# Altium project i9plug_RELES_RecC2.PrjPcb
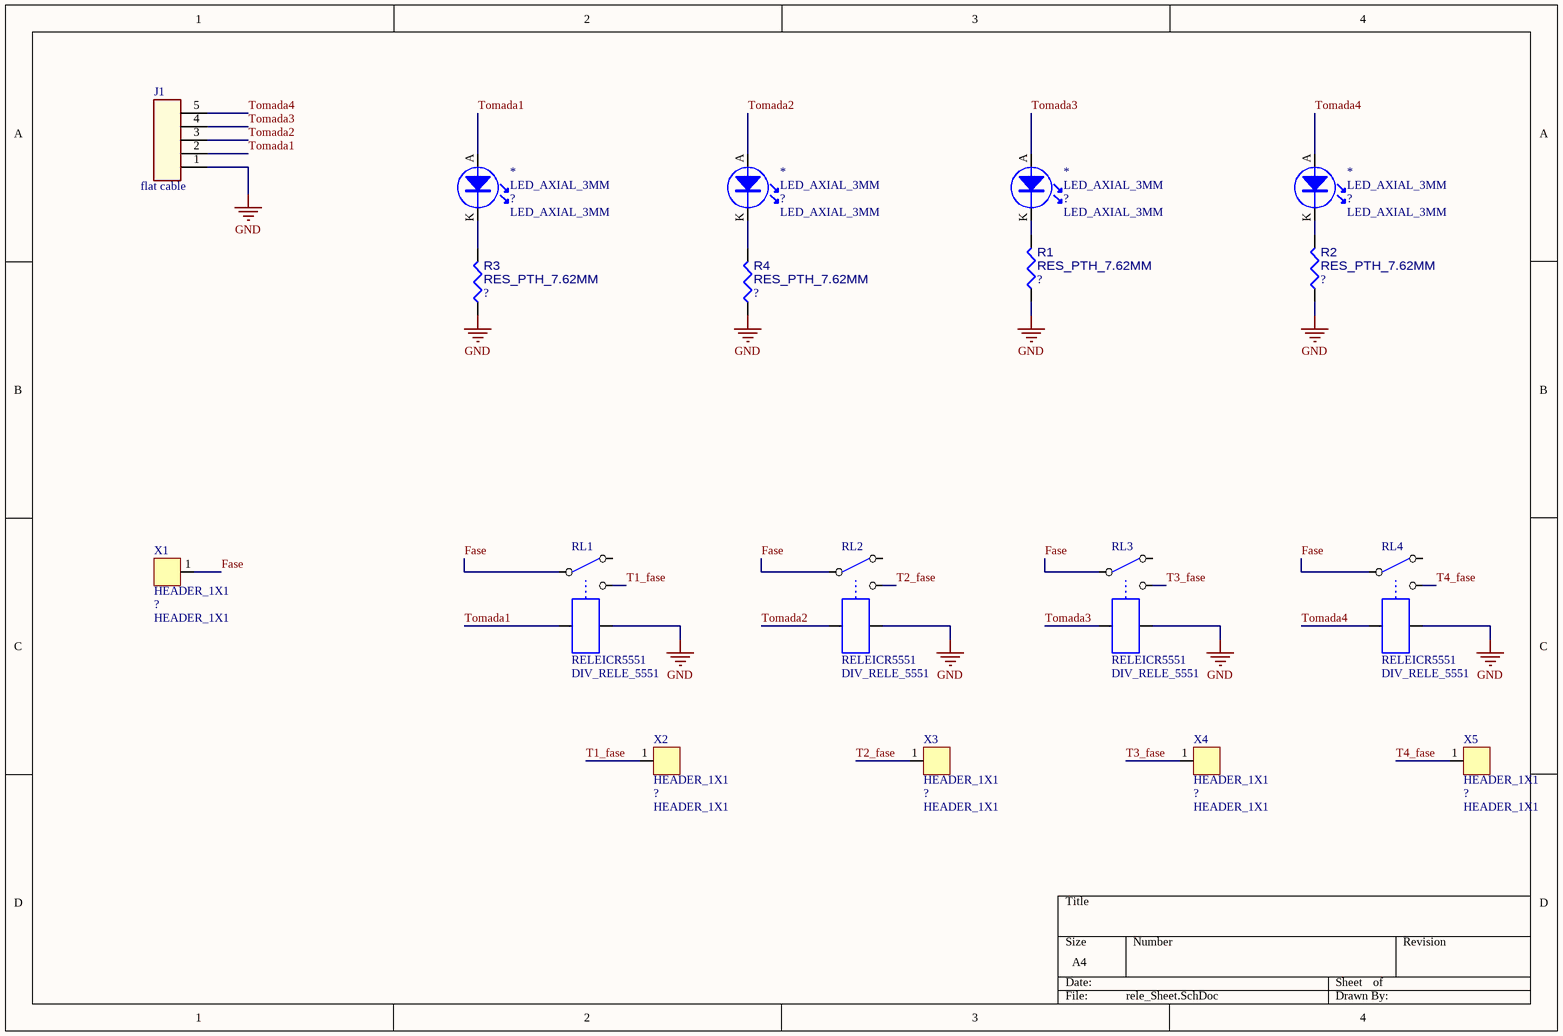
[diagram p0: rele_Sheet.SchDoc]
1 sheet, 18 parts. Net scope: global (net labels, ports and power ports of the same name join across sheets).
Board file: PCB1.PcbDoc

## Sheet rele_Sheet.SchDoc
size A4

### Parts
(Parts that share a designator on the sheet are numbered #1, #2 ... from top to bottom, then left to right.)
*#1  LED_AXIAL_3MM  [LED_AXIAL_3MM]
*#2  LED_AXIAL_3MM  [LED_AXIAL_3MM]
*#3  LED_AXIAL_3MM  [LED_AXIAL_3MM]
*#4  LED_AXIAL_3MM  [LED_AXIAL_3MM]
J1  flat cable  [Pin Header 5 Ways]
R1  ?  [RES_PTH_7.62MM]
R2  ?  [RES_PTH_7.62MM]
R3  ?  [RES_PTH_7.62MM]
R4  ?  [RES_PTH_7.62MM]
RL1  RELEICR5551  [DIV_RELE_5551]
RL2  RELEICR5551  [DIV_RELE_5551]
RL3  RELEICR5551  [DIV_RELE_5551]
RL4  RELEICR5551  [DIV_RELE_5551]
X1  HEADER_1X1  [HEADER_1X1]
X2  HEADER_1X1  [HEADER_1X1]
X3  HEADER_1X1  [HEADER_1X1]
X4  HEADER_1X1  [HEADER_1X1]
X5  HEADER_1X1  [HEADER_1X1]

### Nets
GND: J1.1 R1.1 R2.1 R3.1 R4.1 RL1.5 RL2.5 RL3.5 RL4.5
Fase: RL1.1 RL2.1 RL3.1 RL4.1 X1.1
T1_fase: RL1.3 X2.1
T2_fase: RL2.3 X3.1
T3_fase: RL3.3 X4.1
T4_fase: RL4.3 X5.1
Tomada1: *#1.A J1.2 RL1.4
Tomada2: *#2.A J1.3 RL2.4
Tomada3: *#3.A J1.4 RL3.4
Tomada4: *#4.A J1.5 RL4.4
Net*#1_K: *#1.K R3.2
Net*#2_K: *#2.K R4.2
Net*#3_K: *#3.K R1.2
Net*#4_K: *#4.K R2.2

Not connected (* = marked no-connect by the designer): RL1 2; RL2 2; RL3 2; RL4 2

### Library data of the parts
J1 = Pin Header 5 ways: Connector Header PTH 0.100" (2.54mm); Manufacturer 1: Irwin Inc.; Manufacturer 1 PN: M20-9992046
R1-R4 = RES_PTH_7.62MM: Pin Through Hole Resistor 7.62mm; Value: ?
X1-X5 = HEADER_1X1: 1X1; Value: ?
*#1-*#4 = LED_AXIAL_3MM: Value: ?
RL1-RL4 = RELEICR5551: Value: RELEICR5551